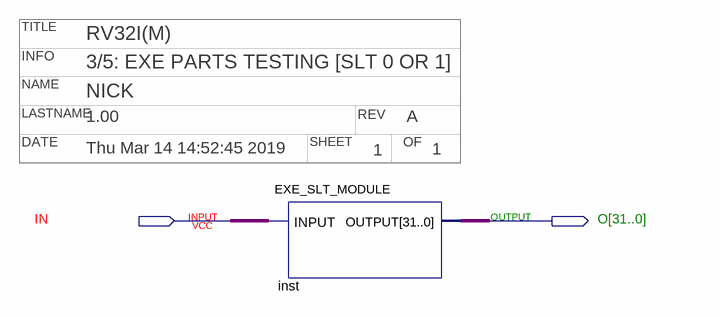
[diagram p0: schematic sheet]
// Quartus schematic EXE_SLT_MODULETEST.bdf as structural Verilog: 1 symbols, 2 pins
// Title block: TITLE: RV32I(M); INFO: 3/5: EXE PARTS TESTING [SLT 0 OR 1]; NAME: NICK; LASTNAME: 1.00; REV: A; DATE: Thu Mar 14 14:52:45 2019; SHEET: 1; OF: 1
module EXE_SLT_MODULETEST (
  input  IN,
  output [31:0] O
);

  EXE_SLT_MODULE inst (.INPUT(IN), .OUTPUT(O));
endmodule
